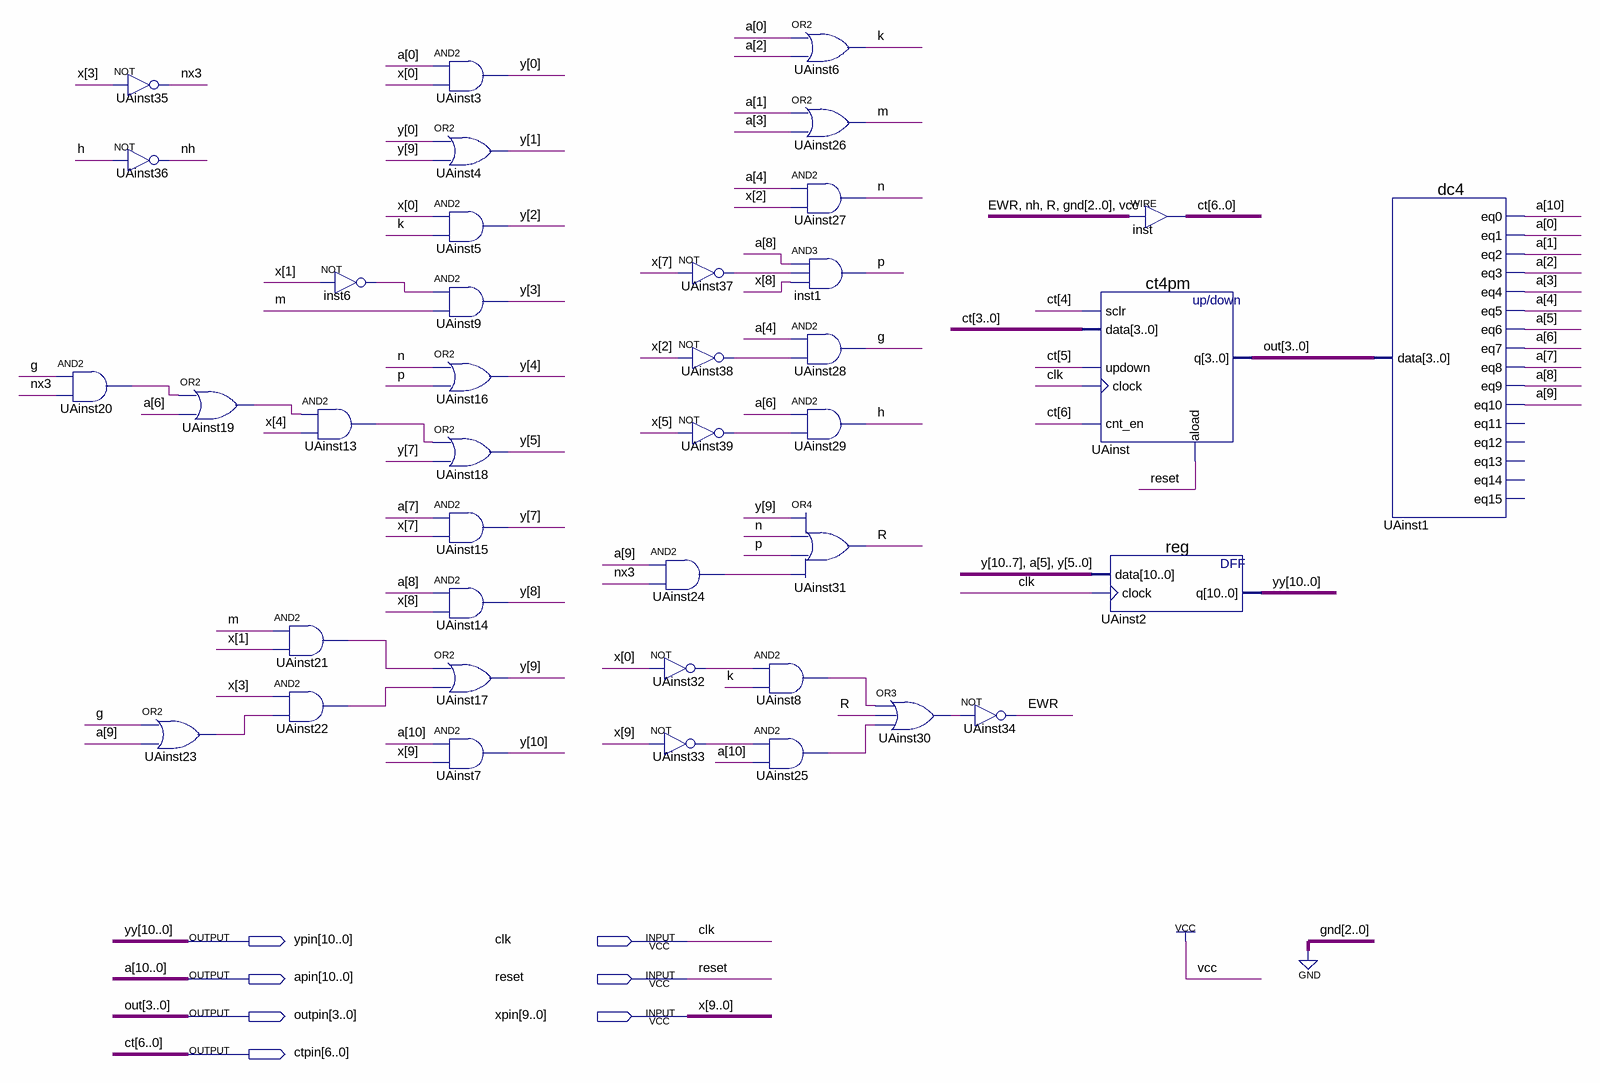
[diagram p0: schematic sheet]
// Quartus schematic lab22.bdf as structural Verilog: 40 symbols, 7 pins
module lab22 (
  input  clk,
  input  reset,
  input  [9:0] xpin,
  output [10:0] ypin,
  output [10:0] apin,
  output [3:0] outpin,
  output [6:0] ctpin
);

  wire EWR, g, h, inst6_out, k, m, n, nh, nx3, p, R, UAinst8_out, UAinst13_out, UAinst19_out, UAinst20_out,
       UAinst21_out, UAinst22_out, UAinst23_out, UAinst24_out, UAinst25_out, UAinst30_out, UAinst32_out,
       UAinst33_out, UAinst37_out, UAinst38_out, UAinst39_out;
  wire [10:0] y;

  and UAinst20 (UAinst20_out, g, nx3);
  not UAinst35 (nx3, xpin[3]);
  not UAinst36 (nh, h);
  or UAinst19 (UAinst19_out, UAinst20_out, apin[6]);
  or UAinst23 (UAinst23_out, g, apin[9]);
  and UAinst21 (UAinst21_out, m, xpin[1]);
  and UAinst22 (UAinst22_out, xpin[3], UAinst23_out);
  not inst6 (inst6_out, xpin[1]);
  and UAinst13 (UAinst13_out, UAinst19_out, xpin[4]);
  and UAinst3 (y[0], apin[0], xpin[0]);
  or UAinst4 (y[1], y[0], y[9]);
  and UAinst5 (y[2], xpin[0], k);
  and UAinst9 (y[3], inst6_out, m);
  or UAinst16 (y[4], n, p);
  or UAinst18 (y[5], UAinst13_out, y[7]);
  and UAinst15 (y[7], apin[7], xpin[7]);
  and UAinst14 (y[8], apin[8], xpin[8]);
  or UAinst17 (y[9], UAinst21_out, UAinst22_out);
  and UAinst7 (y[10], apin[10], xpin[9]);
  and UAinst24 (UAinst24_out, apin[9], nx3);
  not UAinst32 (UAinst32_out, xpin[0]);
  not UAinst33 (UAinst33_out, xpin[9]);
  not UAinst37 (UAinst37_out, xpin[7]);
  not UAinst38 (UAinst38_out, xpin[2]);
  not UAinst39 (UAinst39_out, xpin[5]);
  or UAinst6 (k, apin[0], apin[2]);
  or UAinst26 (m, apin[1], apin[3]);
  and UAinst27 (n, apin[4], xpin[2]);
  and inst1 (p, apin[8], UAinst37_out, xpin[8]);
  and UAinst28 (g, apin[4], UAinst38_out);
  and UAinst29 (h, apin[6], UAinst39_out);
  or UAinst31 (R, y[9], n, p, UAinst24_out);
  and UAinst8 (UAinst8_out, UAinst32_out, k);
  and UAinst25 (UAinst25_out, UAinst33_out, apin[10]);
  or UAinst30 (UAinst30_out, UAinst8_out, R, UAinst25_out);
  not UAinst34 (EWR, UAinst30_out);
  ct4pm UAinst (
    .sclr(ctpin[4]), .data(ctpin[3:0]), .updown(ctpin[5]), .clock(clk), .cnt_en(ctpin[6]), .aload(reset),
    .q(outpin));
  \reg  UAinst2 (.data({y[10:7], apin[5], y[5:0]}), .clock(clk), .q(ypin));
  assign ctpin = {EWR, nh, R, 4'b0001};  // WIRE inst
  dc4 UAinst1 (
    .data(outpin), .eq0(apin[10]), .eq1(apin[0]), .eq2(apin[1]), .eq3(apin[2]), .eq4(apin[3]), .eq5(apin[4]),
    .eq6(apin[5]), .eq7(apin[6]), .eq8(apin[7]), .eq9(apin[8]), .eq10(apin[9]));  // open: eq11, eq12, eq13, eq14, eq15

  // Other names for the same wires on the sheet: a[10:0] = apin; ct[6:0] = ctpin; out[3:0] = outpin; x[9:0] = xpin;
  //   yy[10:0] = ypin
endmodule
